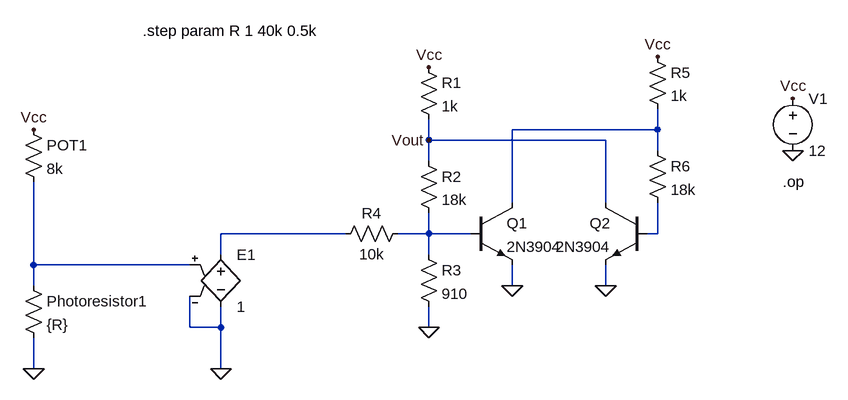
[diagram p0: schematic schmitt_trigger_bjts_2.asc]
schmitt_trigger_bjts_2.asc, the LTspice schematic file:
Version 4.1
SHEET 1 880 680
WIRE 304 144 304 112
WIRE 304 144 80 144
WIRE -48 160 -48 128
WIRE 224 160 -48 160
WIRE 304 176 304 144
WIRE -48 192 -48 160
WIRE 80 256 80 144
WIRE 224 256 224 160
WIRE -176 304 -368 304
WIRE -48 304 -48 272
WIRE -48 304 -96 304
WIRE 16 304 -48 304
WIRE 304 304 304 256
WIRE 304 304 288 304
WIRE -368 336 -368 304
WIRE -48 336 -48 304
WIRE -656 352 -656 224
WIRE -416 352 -656 352
WIRE -656 384 -656 352
WIRE 80 384 80 352
WIRE 224 384 224 352
WIRE -416 448 -416 400
WIRE -368 448 -368 416
WIRE -368 448 -416 448
WIRE -48 448 -48 416
WIRE -656 512 -656 464
WIRE -368 512 -368 448
FLAG 224 384 0
FLAG 80 384 0
FLAG -48 448 0
FLAG 304 32 Vcc
FLAG -48 48 Vcc
FLAG 512 96 Vcc
FLAG 512 176 0
FLAG -656 512 0
FLAG -656 144 Vcc
FLAG -48 160 Vout
FLAG -368 512 0
SYMBOL res -64 32 R0
SYMATTR InstName R1
SYMATTR Value 1k
SYMBOL res -64 176 R0
SYMATTR InstName R2
SYMATTR Value 18k
SYMBOL res -64 320 R0
SYMATTR InstName R3
SYMATTR Value 910
SYMBOL res -80 288 R90
WINDOW 0 0 56 VBottom 2
WINDOW 3 32 56 VTop 2
SYMATTR InstName R4
SYMATTR Value 10k
SYMBOL res 288 16 R0
SYMATTR InstName R5
SYMATTR Value 1k
SYMBOL res 288 160 R0
SYMATTR InstName R6
SYMATTR Value 18k
SYMBOL npn 16 256 R0
SYMATTR InstName Q1
SYMATTR Value 2N3904
SYMBOL npn 288 256 M0
SYMATTR InstName Q2
SYMATTR Value 2N3904
SYMBOL voltage 512 80 R0
WINDOW 123 0 0 Left 2
WINDOW 39 0 0 Left 2
SYMATTR InstName V1
SYMATTR Value 12
SYMBOL res -672 368 R0
SYMATTR InstName Photoresistor1
SYMATTR Value {R}
SYMBOL res -672 128 R0
SYMATTR InstName POT1
SYMATTR Value 8k
SYMATTR SpiceLine tol=1 pwr=0.1
SYMBOL e -368 320 R0
SYMATTR InstName E1
SYMATTR Value 1
TEXT 496 224 Left 2 !.op
TEXT -488 -8 Left 2 !.step param R 1 40k 0.5k

The netlist it stands for:
* schmitt_trigger_bjts_2.asc
R1 Vcc Vout 1k
R2 Vout N003 18k
R3 N003 0 910
R4 N003 N002 10k
R5 Vcc N001 1k
R6 N001 N004 18k
Q1 N001 N003 0 0 2N3904
Q2 Vout N004 0 0 2N3904
V1 Vcc 0 12
R§Photoresistor1 N005 0 {R}
R§POT1 Vcc N005 8k tol=1 pwr=0.1
E1 N002 0 N005 0 1
.model NPN NPN
.model PNP PNP
.lib standard.bjt
.op
.step param R 1 40k 0.5k
.backanno
.end